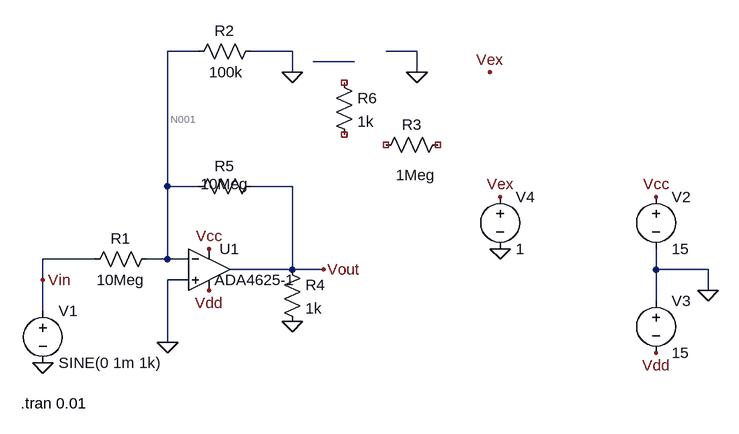
[diagram p0: schematic simul noise test.asc]
* simul noise test.asc
XU1 0 N001 Vcc Vdd Vout ADA4625-1  ; pins In+ In- V+ V- OUT
R1 N001 Vin 10Meg
R2 0 N001 100k
V1 Vin 0 SINE(0 1m 1k)
V2 Vcc 0 15
V3 0 Vdd 15
R3 NC_01 NC_02 1Meg
V4 Vex 0 1
R4 Vout 0 1k
R5 Vout N001 10Meg
R6 NC_03 NC_04 1k
.tran 0.01
.backanno
.end

* Results of the author's LTspice run, read from the files saved beside the schematic
* Operating Point, zero values left out:
*   V(vdd) = -15 V
*   V(vcc) = 15 V
*   V(vout) = 1.048 mV
*   V(n001) = 8.996 µV
*   V(vex) = 1 V
*   I(R5) = 103.9 pA
*   I(R4) = 1.048 µA
*   I(R2) = -89.96 pA
*   I(V3) = -4.001 mA
*   I(V2) = -4.001 mA
*   Ix(u1:1) = 15 pA
*   Ix(u1:2) = 13 pA
*   Ix(u1:3) = 4.001 mA
*   Ix(u1:4) = -4.001 mA
*   Ix(u1:5) = -1.048 µA
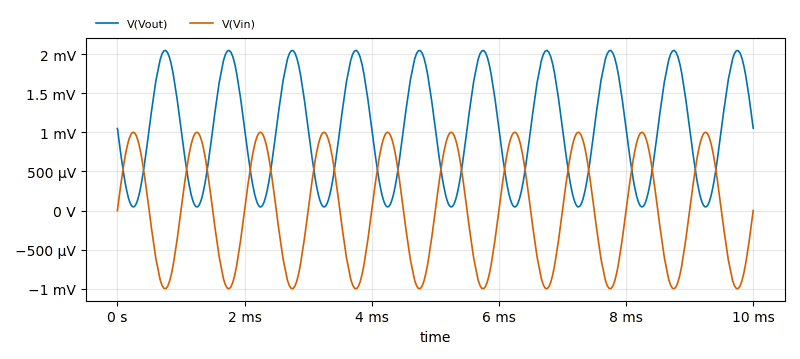
[diagram p1: Transient Analysis of simul noise test.asc, plotted from the saved traces]
* Transient Analysis, 1 run:
*   V(Vout): min 47.56 µV, max 2.047 mV, average 1.046 mV, rms 1.265 mV, last 1.053 mV
*   V(Vin): min -999.1 µV, max 1 mV, average 1.715 µV, rms 711 µV, last 0 V